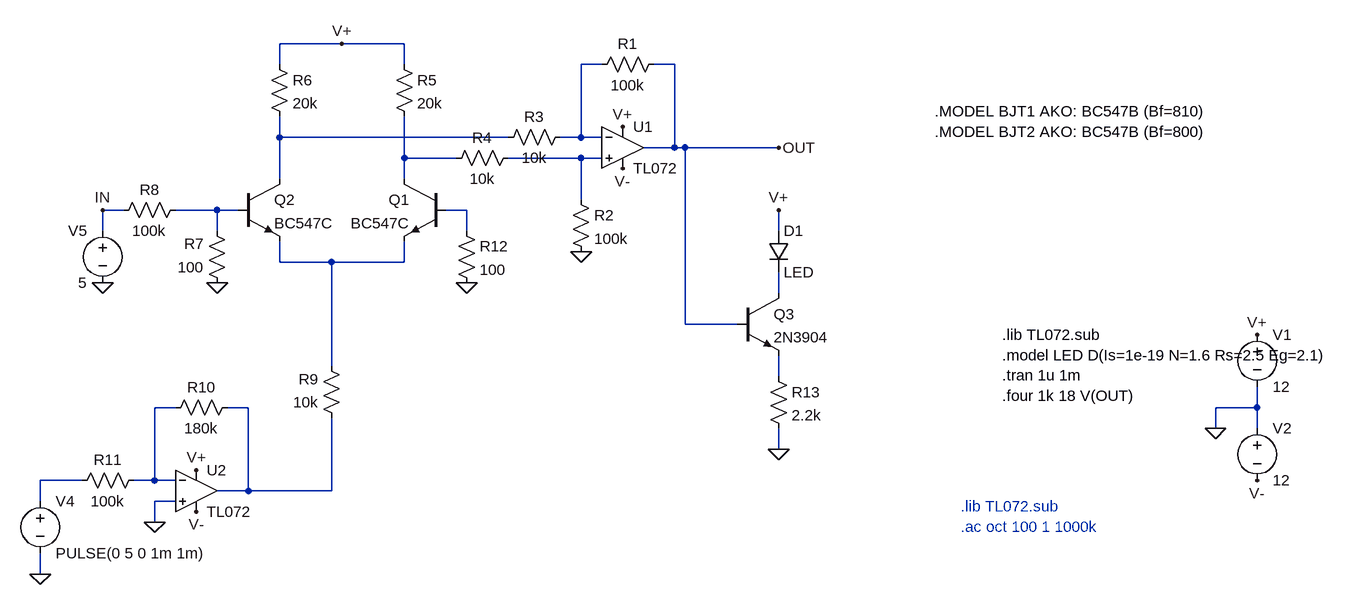
[diagram p0: schematic Transistor VCA.asc]
Transistor VCA.asc, the LTspice schematic file:
Version 4
SHEET 1 1228 896
WIRE -288 -80 -384 -80
WIRE -192 -80 -288 -80
WIRE -384 -48 -384 -80
WIRE -192 -48 -192 -80
WIRE 112 -48 80 -48
WIRE 224 -48 192 -48
WIRE -384 64 -384 32
WIRE -32 64 -384 64
WIRE 80 64 80 -48
WIRE 80 64 48 64
WIRE 112 64 80 64
WIRE 224 80 224 -48
WIRE 224 80 176 80
WIRE 240 80 224 80
WIRE 384 80 240 80
WIRE -192 96 -192 32
WIRE -112 96 -192 96
WIRE 80 96 -32 96
WIRE 112 96 80 96
WIRE -384 128 -384 64
WIRE -192 128 -192 96
WIRE 80 160 80 96
WIRE -624 176 -656 176
WIRE -480 176 -544 176
WIRE -448 176 -480 176
WIRE -96 176 -128 176
WIRE -656 208 -656 176
WIRE -480 208 -480 176
WIRE -96 208 -96 176
WIRE 384 208 384 176
WIRE -384 256 -384 224
WIRE -304 256 -384 256
WIRE -192 256 -192 224
WIRE -192 256 -304 256
WIRE 384 304 384 272
WIRE 240 352 240 80
WIRE 320 352 240 352
WIRE -304 416 -304 256
WIRE 384 432 384 400
WIRE -544 480 -576 480
WIRE -432 480 -464 480
WIRE 1120 480 1120 448
WIRE 1120 480 1056 480
WIRE 1056 512 1056 480
WIRE 1120 512 1120 480
WIRE 384 544 384 512
WIRE -688 592 -752 592
WIRE -576 592 -576 480
WIRE -576 592 -608 592
WIRE -544 592 -576 592
WIRE -432 608 -432 480
WIRE -432 608 -480 608
WIRE -304 608 -304 496
WIRE -304 608 -432 608
WIRE -752 624 -752 592
WIRE -544 624 -576 624
WIRE -576 656 -576 624
WIRE -752 736 -752 704
FLAG 144 112 V-
FLAG 144 48 V+
FLAG 1056 512 0
FLAG 1120 368 V+
FLAG 1120 592 V-
FLAG 80 240 0
FLAG -288 -80 V+
FLAG -480 288 0
FLAG -96 288 0
FLAG -512 640 V-
FLAG -512 576 V+
FLAG -576 656 0
FLAG -752 736 0
FLAG 384 80 OUT
FLAG -656 288 0
FLAG -656 176 IN
FLAG 384 544 0
FLAG 384 176 V+
SYMBOL OpAmps/opamp2 144 16 R0
SYMATTR InstName U1
SYMATTR Value TL072
SYMBOL Voltage 1120 352 R0
SYMATTR InstName V1
SYMATTR Value 12
SYMBOL Voltage 1120 496 R0
SYMATTR InstName V2
SYMATTR Value 12
SYMBOL Res 208 -64 R90
WINDOW 0 0 56 VBottom 2
WINDOW 3 32 56 VTop 2
SYMATTR InstName R1
SYMATTR Value 100k
SYMBOL Res 64 144 R0
SYMATTR InstName R2
SYMATTR Value 100k
SYMBOL Res 64 48 R90
WINDOW 0 0 56 VBottom 2
WINDOW 3 32 56 VTop 2
SYMATTR InstName R3
SYMATTR Value 10k
SYMBOL Res -16 80 R90
WINDOW 0 0 56 VBottom 2
WINDOW 3 32 56 VTop 2
SYMATTR InstName R4
SYMATTR Value 10k
SYMBOL npn -128 128 M0
SYMATTR InstName Q1
SYMATTR Value BC547C
SYMBOL npn -448 128 R0
SYMATTR InstName Q2
SYMATTR Value BC547C
SYMBOL Res -208 -64 R0
SYMATTR InstName R5
SYMATTR Value 20k
SYMBOL Res -400 -64 R0
SYMATTR InstName R6
SYMATTR Value 20k
SYMBOL Res -464 304 R180
WINDOW 0 36 76 Left 2
WINDOW 3 36 40 Left 2
SYMATTR InstName R7
SYMATTR Value 100
SYMBOL Res -640 192 R270
WINDOW 0 32 56 VTop 2
WINDOW 3 0 56 VBottom 2
SYMATTR InstName R8
SYMATTR Value 100k
SYMBOL OpAmps/opamp2 -512 544 R0
SYMATTR InstName U2
SYMATTR Value TL072
SYMBOL Res -288 512 R180
WINDOW 0 36 76 Left 2
WINDOW 3 36 40 Left 2
SYMATTR InstName R9
SYMATTR Value 10k
SYMBOL Res -448 464 R90
WINDOW 0 0 56 VBottom 2
WINDOW 3 32 56 VTop 2
SYMATTR InstName R10
SYMATTR Value 180k
SYMBOL Voltage -752 608 R0
SYMATTR InstName V4
SYMATTR Value PULSE(0 5 0 1m 1m)
SYMBOL Voltage -656 192 M0
SYMATTR InstName V5
SYMATTR Value 5
SYMBOL Res -112 192 R0
SYMATTR InstName R12
SYMATTR Value 100
SYMBOL Res -592 576 R90
WINDOW 0 0 56 VBottom 2
WINDOW 3 32 56 VTop 2
SYMATTR InstName R11
SYMATTR Value 100k
SYMBOL npn 320 304 R0
SYMATTR InstName Q3
SYMATTR Value 2N3904
SYMBOL Res 368 416 R0
SYMATTR InstName R13
SYMATTR Value 2.2k
SYMBOL diode 368 208 R0
SYMATTR InstName D1
SYMATTR Value LED
TEXT 728 368 Left 2 !.lib TL072.sub\n.model LED D(Is=1e-19 N=1.6 Rs=2.5 Eg=2.1)\n.tran 1u 1m\n.four 1k 18 V(OUT)
TEXT 664 632 Left 2 ;.lib TL072.sub\n.ac oct 100 1 1000k
TEXT 624 24 Left 2 !.MODEL BJT1 AKO: BC547B (Bf=810)\n.MODEL BJT2 AKO: BC547B (Bf=800)

The netlist it stands for:
* Transistor VCA.asc
XU1 N004 N001 V+ V- OUT TL072  ; pins In+ In- V+ V- OUT
V1 V+ 0 12
V2 0 V- 12
R1 OUT N001 100k
R2 N004 0 100k
R3 N001 N002 10k
R4 N004 N003 10k
Q1 N003 N006 N007 0 BC547C
Q2 N002 N005 N007 0 BC547C
R5 V+ N003 20k
R6 V+ N002 20k
R7 0 N005 100
R8 IN N005 100k
XU2 0 N010 V+ V- N011 TL072  ; pins In+ In- V+ V- OUT
R9 N011 N007 10k
R10 N011 N010 180k
V4 N012 0 PULSE(0 5 0 1m 1m)
V5 IN 0 5
R12 N006 0 100
R11 N010 N012 100k
Q3 N008 OUT N009 0 2N3904
R13 N009 0 2.2k
D1 V+ N008 LED
.model D D
.lib standard.dio
.model NPN NPN
.model PNP PNP
.lib standard.bjt
.lib TL072.sub
.model LED D(Is=1e-19 N=1.6 Rs=2.5 Eg=2.1)
.tran 1u 1m
.four 1k 18 V(OUT)
* .lib TL072.sub
* .ac oct 100 1 1000k
.MODEL BJT1 AKO: BC547B (Bf=810)
.MODEL BJT2 AKO: BC547B (Bf=800)
.backanno
.end